# EAGLE schematic main (EAGLE 9.0.0)
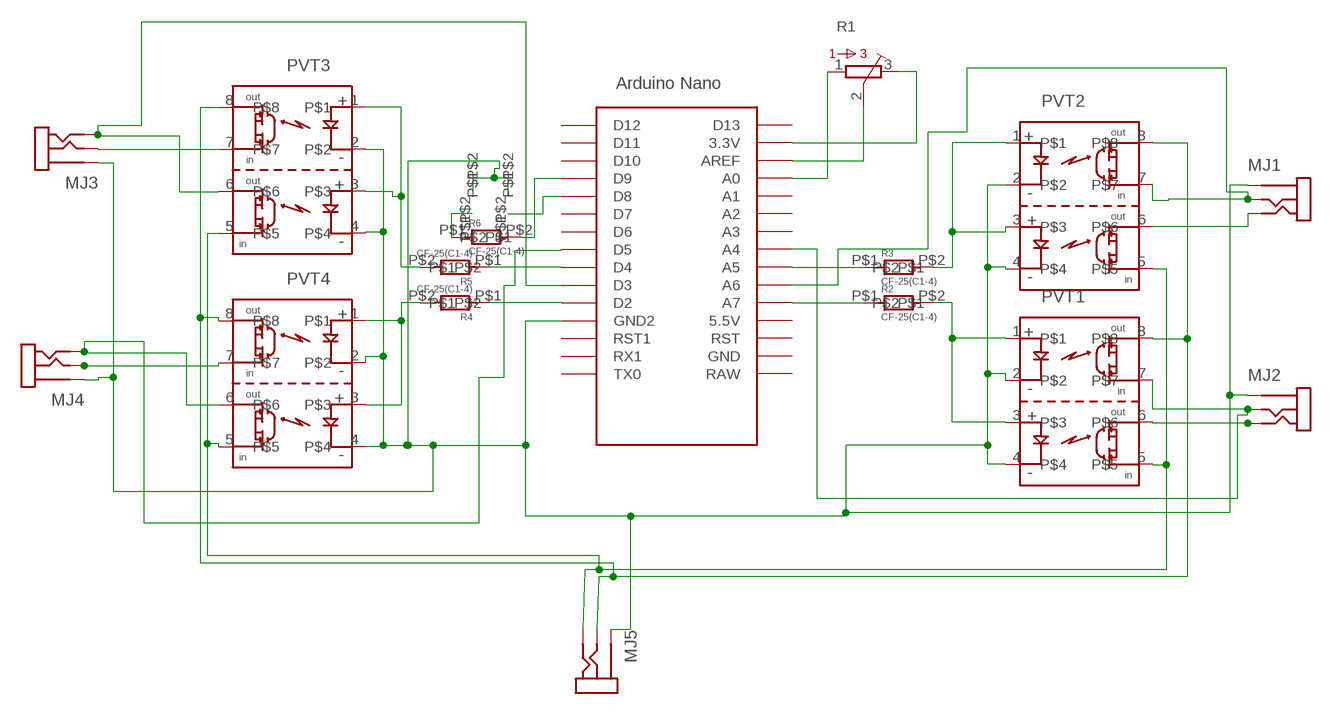
[diagram p0: schematic, sheet 1]

## Parts
MJ1  MINIJACKF  [MINIJACKF]
MJ2  MINIJACKF  [MINIJACKF]
MJ3  MINIJACKF  [MINIJACKF]
MJ4  MINIJACKF  [MINIJACKF]
MJ5  MINIJACKF  [MINIJACKF]
PVT1  PVT322A  [DIP-8]
PVT2  PVT322A  [DIP-8]
PVT3  PVT322A  [DIP-8]
PVT4  PVT322A  [DIP-8]
R1  3362H  [3362H]
R2  CF-25(C1-4)  [CF-25(C1-4)]
R3  CF-25(C1-4)  [CF-25(C1-4)]
R4  CF-25(C1-4)  [CF-25(C1-4)]
R5  CF-25(C1-4)  [CF-25(C1-4)]
R6  CF-25(C1-4)  [CF-25(C1-4)]
U$1  NANO  [NANO]
U$2  2PINCONNECTOR  [2PIN]
U$3  2PINCONNECTOR  [2PIN]

## Nets
N$1: R1.3 U$1.3.3V
N$2: R1.2 U$1.AREF
N$3: R1.1 U$1.A0
N$4: MJ1.LEFT PVT2.7 U$1.A6
N$5: PVT2.1 PVT2.3 R3.P$2
N$6: PVT1.1 PVT1.3 R2.P$2
N$7: R2.P$1 U$1.A7
N$8: R3.P$1 U$1.A5
N$9: R5.P$1 U$1.D4
N$10: R4.P$1 U$1.D2
N$11: MJ2.RIGHT PVT1.6
N$12: PVT3.1 PVT3.3 R5.P$2
N$13: PVT4.1 PVT4.3 R4.P$2
N$14: U$1.D8 U$2.P$1
N$15: MJ2.LEFT PVT1.7 U$1.A4
N$17: R6.P$2 U$1.D9
N$18: MJ3.LEFT PVT3.7
N$19: MJ1.RIGHT PVT2.6
N$20: MJ4.RIGHT PVT4.6 U$1.D5
N$21: MJ4.LEFT PVT4.7
N$22: MJ3.RIGHT PVT3.6 U$1.D3
N$23: R6.P$1 U$3.P$1
N$24: MJ5.RIGHT PVT1.5 PVT2.5 PVT3.5 PVT4.5
N$25: MJ1.GND MJ2.GND MJ3.GND MJ4.GND MJ5.GND PVT1.2 PVT1.4 PVT2.2 PVT2.4 PVT3.2 PVT3.4 PVT4.2 PVT4.4 U$1.GND1(GND2) U$2.P$2 U$3.P$2
N$26: MJ5.LEFT PVT1.8 PVT2.8 PVT3.8 PVT4.8
Unconnected: U$1.5V(5.5V) U$1.A1 U$1.A2 U$1.A3 U$1.D6 U$1.D7 U$1.D10 U$1.D11 U$1.D12 U$1.D13 U$1.GND U$1.RAW U$1.RST U$1.RST1 U$1.RX1 U$1.TX0

## Library data of the parts
MJ1-MJ5 = MiniJack:MINIJACKF
PVT1-PVT4 = PVT322:PVT322A
R1 = bourns:3362: 3362 Series 1/4" Square Trimmer
R2-R6 = resistance:CF-25(C1-4)
U$1 = Arduino-clone:NANO: Arduino Nano
U$2 U$3 = resistance:2PINCONNECTOR